# Altium schematic sheet ADCAN.SchDoc
size A4; DocumentNumber: 0; SheetNumber: 1; SheetTotal: 7
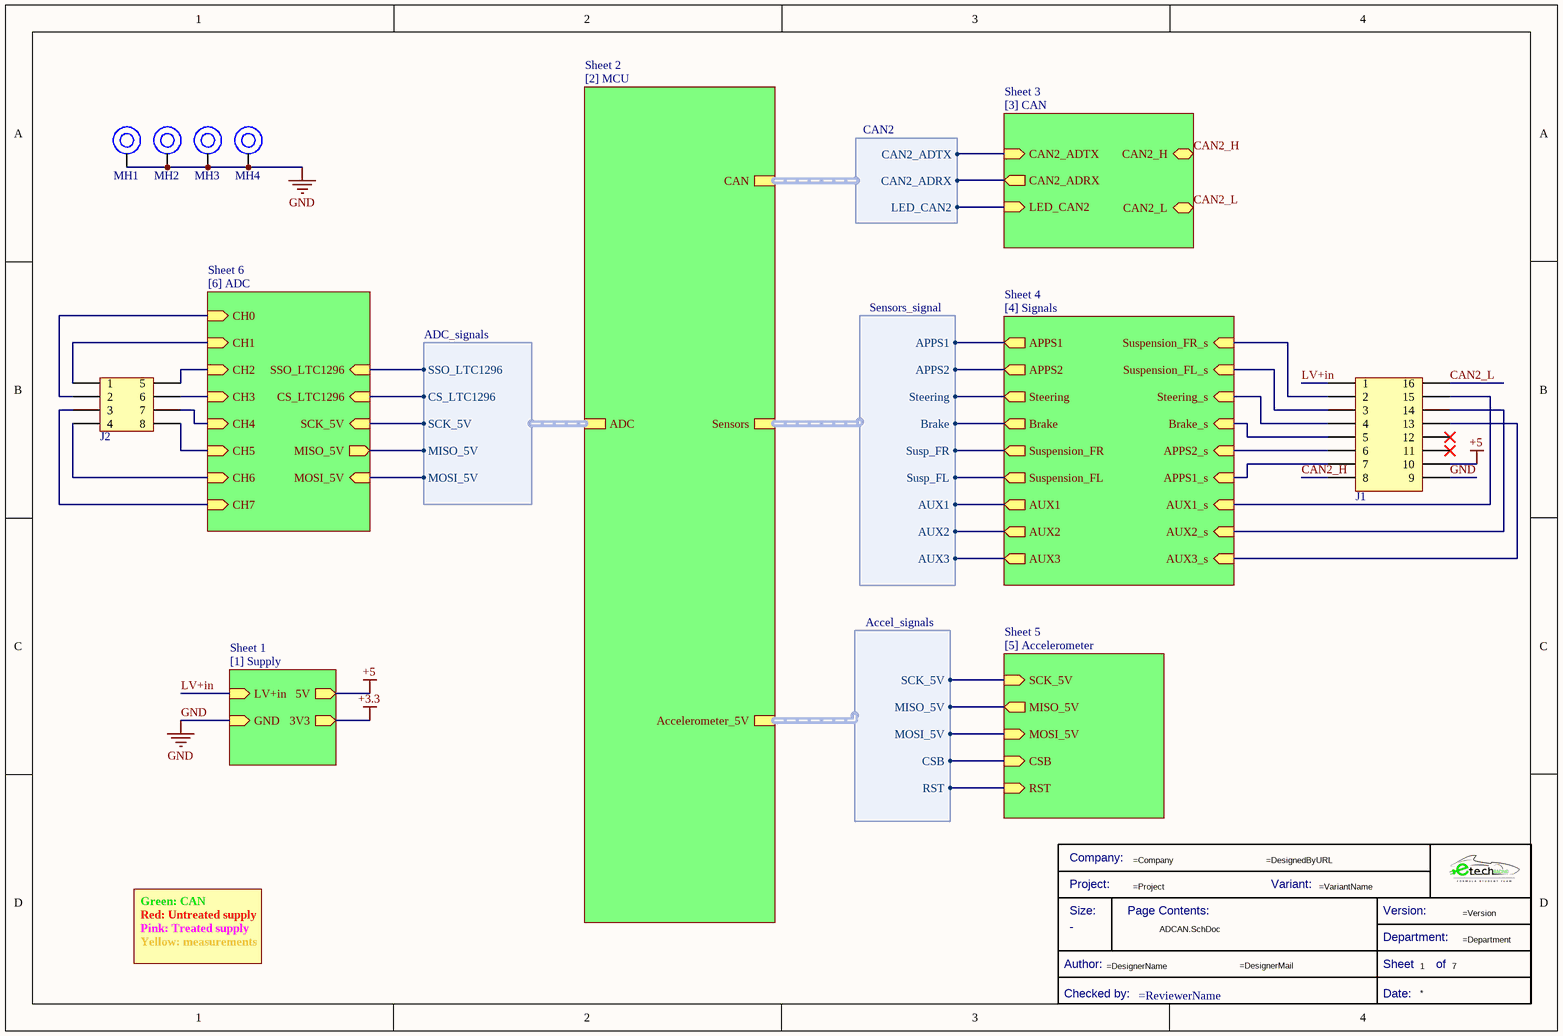
[diagram p0: ADCAN.SchDoc]

## Parts
*  Title Block_template  (value not drawn)  (graphical)
J1  1053141116  [J_NanoFit_2x8]  (value not drawn)
J2  105314-1108  [J_NanoFit_2X4]  (value not drawn)
MH1  Mounting_Hole_M3  [Mounting_Hole_M3]  (value not drawn)
MH2  Mounting_Hole_M3  [Mounting_Hole_M3]  (value not drawn)
MH3  Mounting_Hole_M3  [Mounting_Hole_M3]  (value not drawn)
MH4  Mounting_Hole_M3  [Mounting_Hole_M3]  (value not drawn)

## Sub-sheets
Sheet 1 = [1] Supply: 5V (out), 3V3 (out), LV+in (in), GND (in)
Sheet 2 = [2] MCU: CAN (harness CAN2), Sensors (harness Sensors_signal), Accelerometer_5V (harness Accel_signals), ADC (harness ADC_signals)
Sheet 3 = [3] CAN: CAN2_ADTX (in), CAN2_ADRX (out), LED_CAN2 (in), CAN2_H (bidir), CAN2_L (bidir)
Sheet 4 = [4] Signals: APPS1 (out), APPS2 (out), Steering (out), Brake (out), Suspension_FR (out), Suspension_FL (out), APPS1_s (in), APPS2_s (in), Brake_s (in), Steering_s (in), Suspension_FL_s (in), Suspension_FR_s (in), AUX1 (out), AUX2 (out), AUX1_s (in), AUX2_s (in), AUX3 (out), AUX3_s (in)
Sheet 5 = [5] Accelerometer: SCK_5V (in), MISO_5V (out), MOSI_5V (in), CSB (in), RST (in)
Sheet 6 = [6] ADC: SSO_LTC1296 (in), SCK_5V (in), CS_LTC1296 (in), CH0 (in), CH1 (in), CH2 (in), CH3 (in), CH4 (in), CH5 (in), CH6 (in), CH7 (in), MISO_5V (out), MOSI_5V (in)

## Harnesses
CAN2: CAN2_ADTX, CAN2_ADRX, LED_CAN2
Sensors_signal: APPS1, APPS2, Steering, Brake, Susp_FR, Susp_FL, AUX1, AUX2, AUX3
Accel_signals: SCK_5V, MISO_5V, MOSI_5V, CSB, RST
ADC_signals: SSO_LTC1296, CS_LTC1296, SCK_5V, MISO_5V, MOSI_5V

## Nets
+3.3: sheet Sheet 1/3V3
+5: J1.10 ; sheet Sheet 1/5V
GND: J1.9 MH1.1 MH2.1 MH3.1 MH4.1 ; sheet Sheet 1/GND
CAN2_H: J1.8 ; sheet Sheet 3/CAN2_H
CAN2_L: J1.16 ; sheet Sheet 3/CAN2_L
LV+in: J1.1 ; sheet Sheet 1/LV+in
NetJ1_2: J1.2 ; sheet Sheet 4/Suspension_FR_s
NetJ1_3: J1.3 ; sheet Sheet 4/Suspension_FL_s
NetJ1_4: J1.4 ; sheet Sheet 4/Steering_s
NetJ1_5: J1.5 ; sheet Sheet 4/Brake_s
NetJ1_6: J1.6 ; sheet Sheet 4/APPS2_s
NetJ1_7: J1.7 ; sheet Sheet 4/APPS1_s
NetJ1_13: J1.13 ; sheet Sheet 4/AUX3_s
NetJ1_14: J1.14 ; sheet Sheet 4/AUX2_s
NetJ1_15: J1.15 ; sheet Sheet 4/AUX1_s
NetJ2_1: J2.1 ; sheet Sheet 6/CH1
NetJ2_2: J2.2 ; sheet Sheet 6/CH0
NetJ2_3: J2.3 ; sheet Sheet 6/CH7
NetJ2_4: J2.4 ; sheet Sheet 6/CH6
NetJ2_5: J2.5 ; sheet Sheet 6/CH2
NetJ2_6: J2.6 ; sheet Sheet 6/CH3
NetJ2_7: J2.7 ; sheet Sheet 6/CH4
NetJ2_8: J2.8 ; sheet Sheet 6/CH5
(unnamed): sheet Sheet 3/CAN2_ADTX, sheet Sheet 2/CAN.CAN2_ADTX
(unnamed): sheet Sheet 3/CAN2_ADRX, sheet Sheet 2/CAN.CAN2_ADRX
(unnamed): sheet Sheet 3/LED_CAN2, sheet Sheet 2/CAN.LED_CAN2
(unnamed): sheet Sheet 4/APPS1, sheet Sheet 2/Sensors.APPS1
(unnamed): sheet Sheet 4/APPS2, sheet Sheet 2/Sensors.APPS2
(unnamed): sheet Sheet 4/Steering, sheet Sheet 2/Sensors.Steering
(unnamed): sheet Sheet 4/Brake, sheet Sheet 2/Sensors.Brake
(unnamed): sheet Sheet 4/Suspension_FR, sheet Sheet 2/Sensors.Susp_FR
(unnamed): sheet Sheet 4/Suspension_FL, sheet Sheet 2/Sensors.Susp_FL
(unnamed): sheet Sheet 4/AUX1, sheet Sheet 2/Sensors.AUX1
(unnamed): sheet Sheet 4/AUX2, sheet Sheet 2/Sensors.AUX2
(unnamed): sheet Sheet 4/AUX3, sheet Sheet 2/Sensors.AUX3
(unnamed): sheet Sheet 5/SCK_5V, sheet Sheet 2/Accelerometer_5V.SCK_5V
(unnamed): sheet Sheet 5/MISO_5V, sheet Sheet 2/Accelerometer_5V.MISO_5V
(unnamed): sheet Sheet 5/MOSI_5V, sheet Sheet 2/Accelerometer_5V.MOSI_5V
(unnamed): sheet Sheet 5/CSB, sheet Sheet 2/Accelerometer_5V.CSB
(unnamed): sheet Sheet 5/RST, sheet Sheet 2/Accelerometer_5V.RST
(unnamed): sheet Sheet 6/SSO_LTC1296, sheet Sheet 2/ADC.SSO_LTC1296
(unnamed): sheet Sheet 6/SCK_5V, sheet Sheet 2/ADC.SCK_5V
(unnamed): sheet Sheet 6/CS_LTC1296, sheet Sheet 2/ADC.CS_LTC1296
(unnamed): sheet Sheet 6/MISO_5V, sheet Sheet 2/ADC.MISO_5V
(unnamed): sheet Sheet 6/MOSI_5V, sheet Sheet 2/ADC.MOSI_5V

Not connected (* = marked no-connect by the designer): J1 11* 12*

## Notes on the sheet
- Red: Untreated supply
- Green: CAN
- Yellow: measurements
- Pink: Treated supply
- (in symbol Title Block_template) Company:; Project:; Variant:; Size:; Page Contents:; Version:; Department:; Author:; Sheet; of; Checked by:; Date:

## Library data of the parts
* = Title Block_template: Standard Title Block; .Creator: GP; Category: Title Block; .PCBcheck: GP; .SCHcheck: GP; Checked by:: =ReviewerName; Size: -
J1 = J_NanoFit_2x8: Nano-Fit Right Angle Header Through Hole 2.50mm Pitch Dual Row 16 Circuits Tin (Sn) Plating Black; Manufacturer: Molex; Manufacturer Part Number: 105314-1116; .Creator: DO; ComponentLink1URL: https://www.molex.com/pdm_docs/ps/PS-105300-100-001.pdf?src-supplier=Digi-Key; ComponentLink1Description: https://www.molex.com/pdm_docs/ps/PS-105300-100-001.pdf?src-supplier=Digi-Key; ComponentLink2Description: Where buy it; ComponentLink2URL: https://www.molex.com/molex/products/part-detail/pcb_headers/1053141116; Supplier 1: Newark; RoHS: Yes; Category: Headers and Wire Housings; Stock 1: 366; Pricing 1: 1=3,37000, 10=3,24000, 25=2,88000, 50=2,81000, 100=2,73000, 250=2,44000 (USD); Supplier Part Number 1: 33AC7692
J2 = J_NanoFit_2x4: Nano-Fit Right Angle Header Through Hole 2.50mm Pitch Dual Row 8 Circuits Tin (Sn) Plating Black; Manufacturer: Molex; Temperature rating: -40° to +105°C; Category type: PCB header; Maximum current: 7.5 A; Maximum voltage: 750 V AC; Connections: 2x4; Connector Type: Header,Male Pin; Number of Positions: 8; .Creator: DO; Category: Connector; ComponentLink1Description: Datasheet; ComponentLink1URL: https://www.molex.com/molex/products/part-detail/pcb_headers/1053141104; ComponentLink2Description: Where buy it; ComponentLink2URL: *; Manufacturer part number: 105314-1108; Supplier: *; RoHS: *; Application: Wire to board; Product name: Nano-Fit; Flammability: 94V-0; Orientation: Right Angle; Mount: Through hole; Supplier 1: Digi-Key; Stock 1: 11021; Pricing 1: 1=1,98000, 10=1,68600, 156=1,39308, 1092=1,09983, 4992=0,97518, 10140=0,95318 (USD); Contact Plating: Tin; Contact Material: Brass; Contact Shape: Square; Insulation Material: Polymer; Insulation Color: Black; Min Operating Temperature: -40°C; Max Operating Temperature: 105°C; Fastening Type: Latch; Packaging: Tray; Number of Rows: 2; Termination: Solder; RoHS Compliant: Yes; ComponentLink3URL: http://www.farnell.com/datasheets/2551096.pdf?src-supplier=Newark; ComponentLink3Description: http://www.farnell.com/datasheets/2551096.pdf?src-supplier=Newark; ComponentLink4URL: https://www.molex.com/pdm_docs/sd/1053141104_sd.pdf?src-supplier=Digi-Key; ComponentLink4Description: https://www.molex.com/pdm_docs/sd/1053141104_sd.pdf?src-supplier=Digi-Key; Supplier Part Number 1: WM16909-ND